# EAGLE design Nebula 1.3 (EAGLE 5.11)

## Sheet 1 of 5
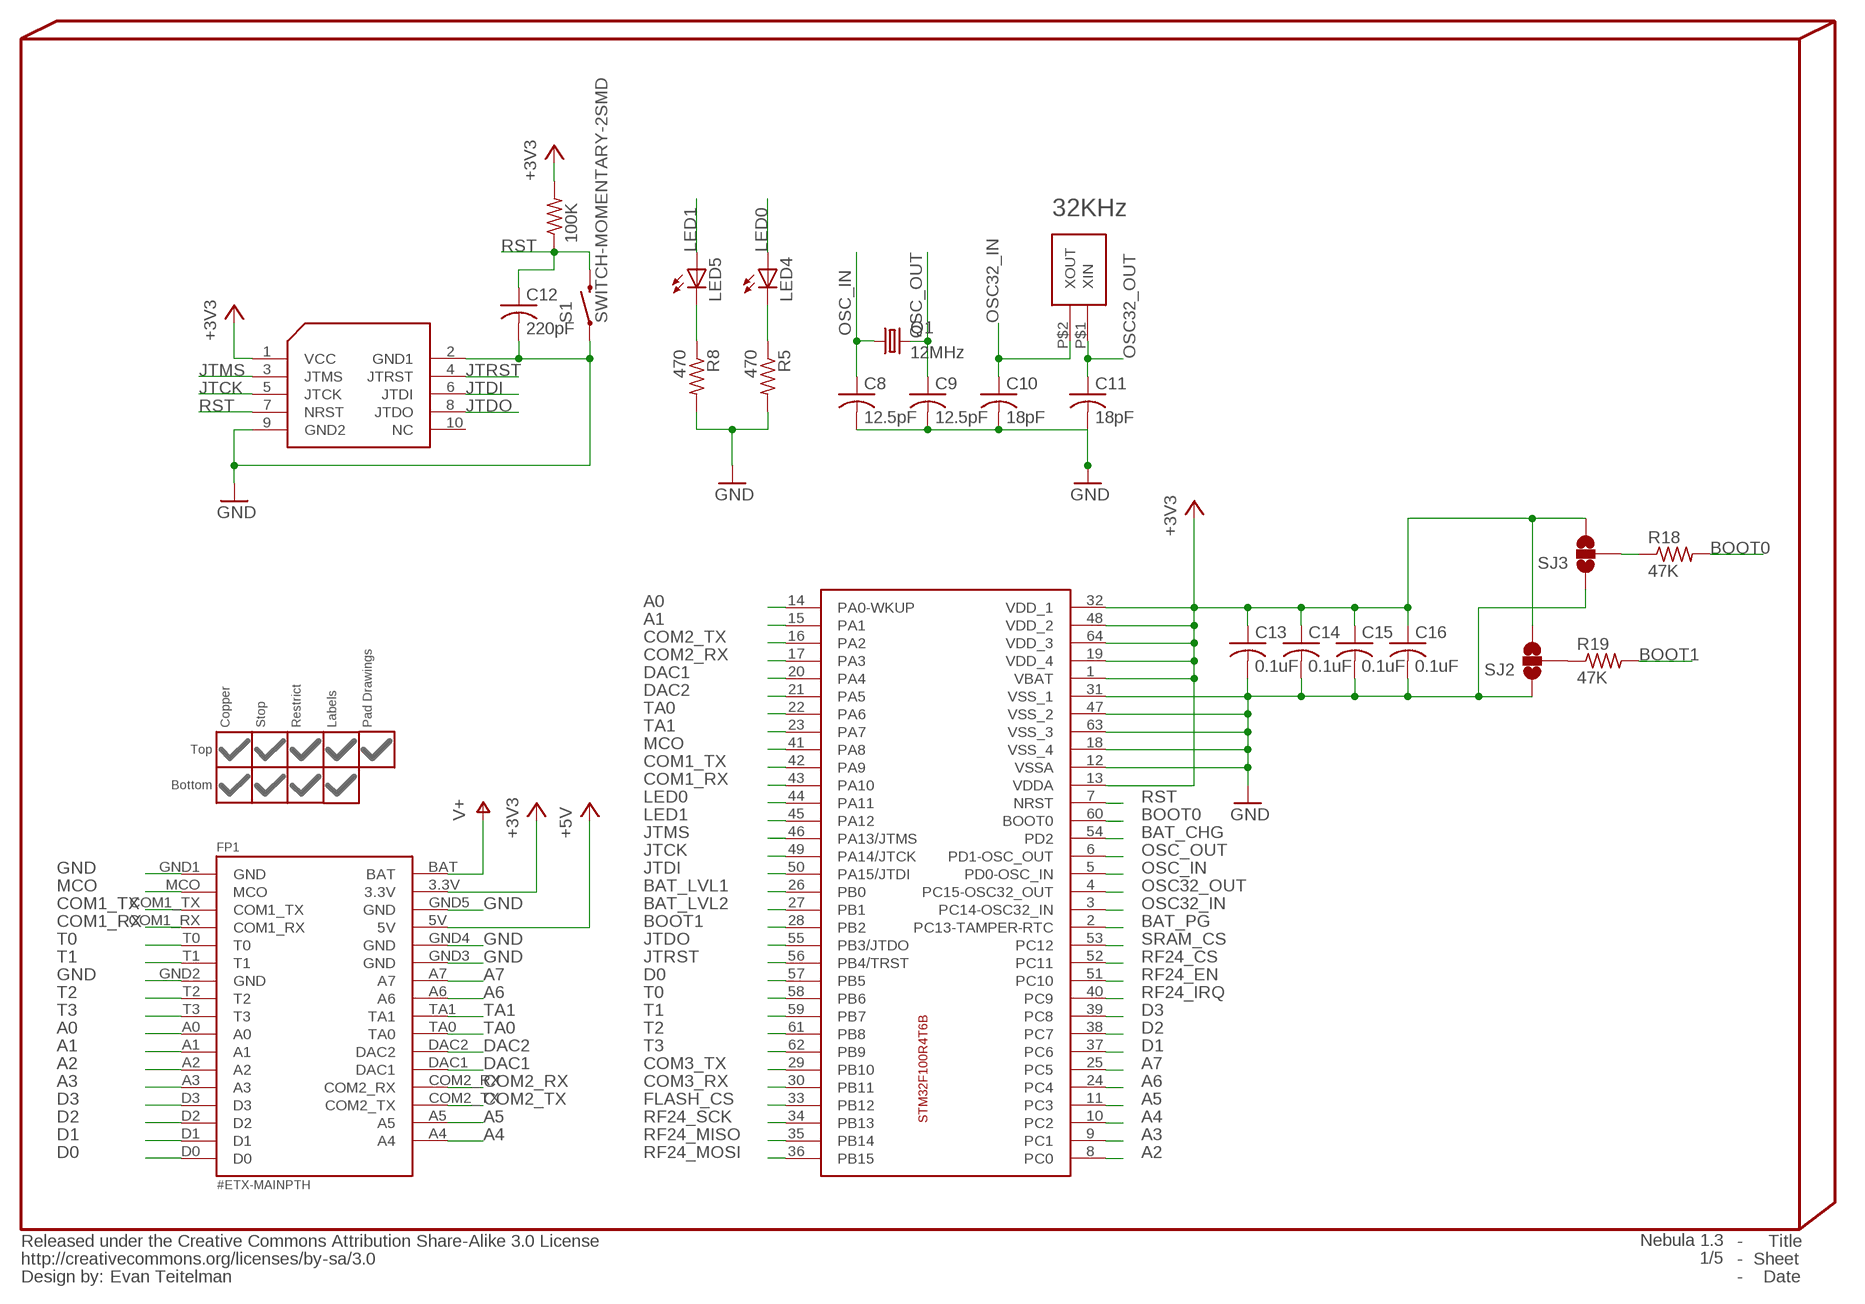
[diagram p0: schematic, sheet 1]

### Parts
C8  12.5pF  C-USC0402  [C0402]
C9  12.5pF  C-USC0402  [C0402]
C10  18pF  C-USC0402  [C0402]
C11  18pF  C-USC0402  [C0402]
C12  220pF  C-USC0402  [C0402]
C13  0.1uF  C-USC0402  [C0402]
C14  0.1uF  C-USC0402  [C0402]
C15  0.1uF  C-USC0402  [C0402]
C16  0.1uF  C-USC0402  [C0402]
FP1  #ETX-MAINPTH  [#ETX-HOLES]
INFO3  Evan Teitelman  CC-BY-SA  [CC-BY-SA]
LED4  LED0603  [LED-0603]
LED5  LED0603  [LED-0603]
PART1  #ETX-PARTLABELS_BOTTOM  [#ETX-LABELS_BOTT]
PART2  #ETX-PARTRESTRICT  [#ETX-RESTRICT]
PART3  #ETX-PARTSTOP  [#ETX-STOP]
Q1  12MHz  CRYSTAL5X3  [CRYSTAL-SMD-5X3]
Q2  CM415  [CM415]
R3  100K  R-US_R0402  [R0402]
R5  470  R-US_R0402  [R0402]
R8  470  R-US_R0402  [R0402]
R18  47K  R-US_R0402  [R0402]
R19  47K  R-US_R0402  [R0402]
S1  SWITCH-MOMENTARY-2SMD  [TACTILE_SWITCH_SMD]
SJ2  SOLDERJUMPER_2WAYPASTE1&2  [SJ_3_PASTE1&2]
SJ3  SOLDERJUMPER_2WAYPASTE1&2  [SJ_3_PASTE1&2]
U3  STM32F100R4T6B  [S-PQFP64-G64]
U$1  STM32-JTAG-10P  [STM32-JTAG-10P]

### Nets
+3V3: C13.1 C14.1 C15.1 C16.1 FP1.3.3V R3.2 SJ2.3 SJ3.3 U3.1(VBAT) U3.13(VDDA) U3.19(VDD_4) U3.32(VDD_1) U3.48(VDD_2) U3.64(VDD_3) U$1.1(VCC) ; also sheet 2,3,5
+5V: FP1.5V ; also sheet 3,4
A0: FP1.A0 U3.14(PA0-WKUP)
A1: FP1.A1 U3.15(PA1)
A2: FP1.A2 U3.8(PC0)
A3: FP1.A3 U3.9(PC1)
A4: FP1.A4 U3.10(PC2)
A5: FP1.A5 U3.11(PC3)
A6: FP1.A6 U3.24(PC4)
A7: FP1.A7 U3.25(PC5)
BAT_CHG: U3.54(PD2) ; also sheet 3
BAT_LVL1: U3.26(PB0) ; also sheet 3
BAT_LVL2: U3.27(PB1) ; also sheet 3
BAT_PG: U3.2(PC13-TAMPER-RTC) ; also sheet 3
BOOT0: R18.2 U3.60(BOOT0)
BOOT1: R19.2 U3.28(PB2)
COM1_RX: FP1.COM1_RX U3.43(PA10)
COM1_TX: FP1.COM1_TX U3.42(PA9)
COM2_RX: FP1.COM2_RX U3.17(PA3)
COM2_TX: FP1.COM2_TX U3.16(PA2)
COM3_RX: U3.30(PB11) ; also sheet 4
COM3_TX: U3.29(PB10) ; also sheet 4
D0: FP1.D0 U3.57(PB5)
D1: FP1.D1 U3.37(PC6)
D2: FP1.D2 U3.38(PC7)
D3: FP1.D3 U3.39(PC8)
DAC1: FP1.DAC1 U3.20(PA4)
DAC2: FP1.DAC2 U3.21(PA5)
FLASH_CS: U3.33(PB12) ; also sheet 5
GND: C8.2 C9.2 C10.2 C11.2 C12.2 C13.2 C14.2 C15.2 C16.2 FP1.GND1(GND) FP1.GND2(GND) FP1.GND3(GND) FP1.GND4(GND) FP1.GND5(GND) R5.2 R8.2 S1.1 SJ2.1 SJ3.1 U3.12(VSSA) U3.18(VSS_4) U3.31(VSS_1) U3.47(VSS_2) U3.63(VSS_3) U$1.2(GND1) U$1.9(GND2) ; also sheet 2,3,4,5
JTCK: U3.49(PA14/JTCK) U$1.5(JTCK)
JTDI: U3.50(PA15/JTDI) U$1.6(JTDI)
JTDO: U3.55(PB3/JTDO) U$1.8(JTDO)
JTMS: U3.46(PA13/JTMS) U$1.3(JTMS)
JTRST: U3.56(PB4/TRST) U$1.4(JTRST)
LED0: LED4.A U3.44(PA11)
LED1: LED5.A U3.45(PA12)
MCO: FP1.MCO U3.41(PA8)
N$31: R18.1 SJ3.2
N$33: R19.1 SJ2.2
N$35: LED5.C R8.1
N$37: LED4.C R5.1
OSC32_IN: C10.1 Q2.P$2(XOUT) U3.3(PC14-OSC32_IN)
OSC32_OUT: C11.1 Q2.P$1(XIN) U3.4(PC15-OSC32_OUT)
OSC_IN: C8.1 Q1.1 U3.5(PD0-OSC_IN)
OSC_OUT: C9.1 Q1.3 U3.6(PD1-OSC_OUT)
RF24_CS: U3.52(PC11) ; also sheet 2
RF24_EN: U3.51(PC10) ; also sheet 2
RF24_IRQ: U3.40(PC9) ; also sheet 2
RF24_MISO: U3.35(PB14) ; also sheet 2,5
RF24_MOSI: U3.36(PB15) ; also sheet 2,5
RF24_SCK: U3.34(PB13) ; also sheet 2,5
RST: C12.1 R3.1 S1.3 U3.7(NRST) U$1.7(NRST)
SRAM_CS: U3.53(PC12) ; also sheet 5
T0: FP1.T0 U3.58(PB6)
T1: FP1.T1 U3.59(PB7)
T2: FP1.T2 U3.61(PB8)
T3: FP1.T3 U3.62(PB9)
TA0: FP1.TA0 U3.22(PA6)
TA1: FP1.TA1 U3.23(PA7)
V+: FP1.BAT ; also sheet 3
Unconnected: U$1.10(NC)

## Sheet 2 of 5
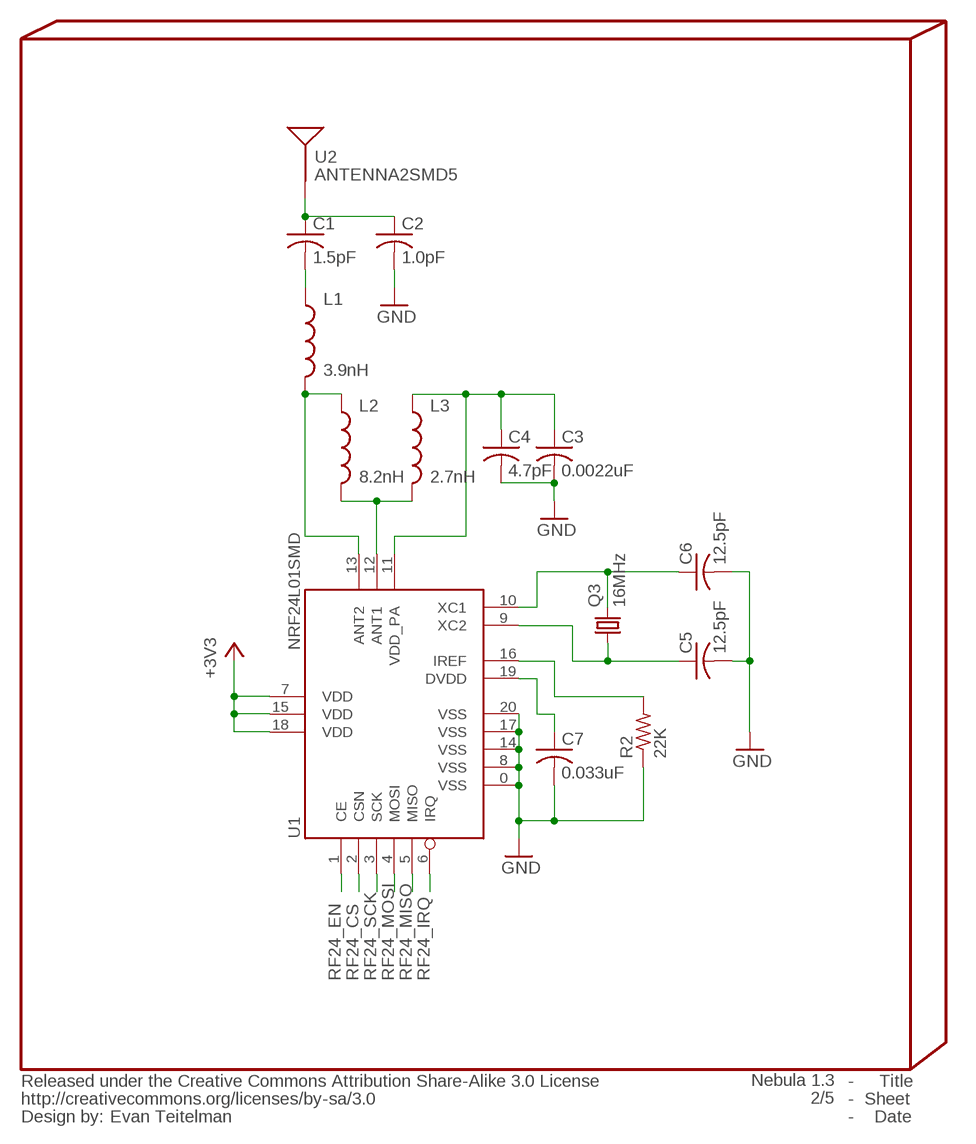
[diagram p1: schematic, sheet 2]

### Parts
C1  1.5pF  C-USC0402  [C0402]
C2  1.0pF  C-USC0402  [C0402]
C3  0.0022uF  C-USC0402  [C0402]
C4  4.7pF  C-USC0402  [C0402]
C5  12.5pF  C-USC0402  [C0402]
C6  12.5pF  C-USC0402  [C0402]
C7  0.033uF  C-USC0402  [C0402]
L1  3.9nH  INDUCTOR0402  [C0402]
L2  8.2nH  INDUCTOR0402  [C0402]
L3  2.7nH  INDUCTOR0402  [C0402]
Q3  16MHz  CRYSTAL5X3  [CRYSTAL-SMD-5X3]
R2  22K  R-US_R0402  [R0402]
U1  NRF24L01SMD  [QFN20]
U2  ANTENNA2SMD5  [ANTENNA-CHIP5]

### Nets
+3V3: U1.7(VDD) U1.15(VDD) U1.18(VDD) ; also sheet 1,3,5
GND: C2.2 C3.2 C4.2 C5.2 C6.2 C7.2 R2.1 U1.0(VSS) U1.8(VSS) U1.14(VSS) U1.17(VSS) U1.20(VSS) ; also sheet 1,3,4,5
N$1: C1.1 C2.1 U2.FEED(SIGNAL)
N$2: C1.2 L1.1
N$3: L1.2 L2.1 U1.13(ANT2)
N$4: L2.2 L3.2 U1.12(ANT1)
N$5: C3.1 C4.1 L3.1 U1.11(VDD_PA)
N$7: C6.1 Q3.3 U1.10(XC1)
N$8: C5.1 Q3.1 U1.9(XC2)
N$10: R2.2 U1.16(IREF)
N$11: C7.1 U1.19(DVDD)
RF24_CS: U1.2(CSN) ; also sheet 1
RF24_EN: U1.1(CE) ; also sheet 1
RF24_IRQ: U1.6(IRQ) ; also sheet 1
RF24_MISO: U1.5(MISO) ; also sheet 1,5
RF24_MOSI: U1.4(MOSI) ; also sheet 1,5
RF24_SCK: U1.3(SCK) ; also sheet 1,5

## Sheet 3 of 5
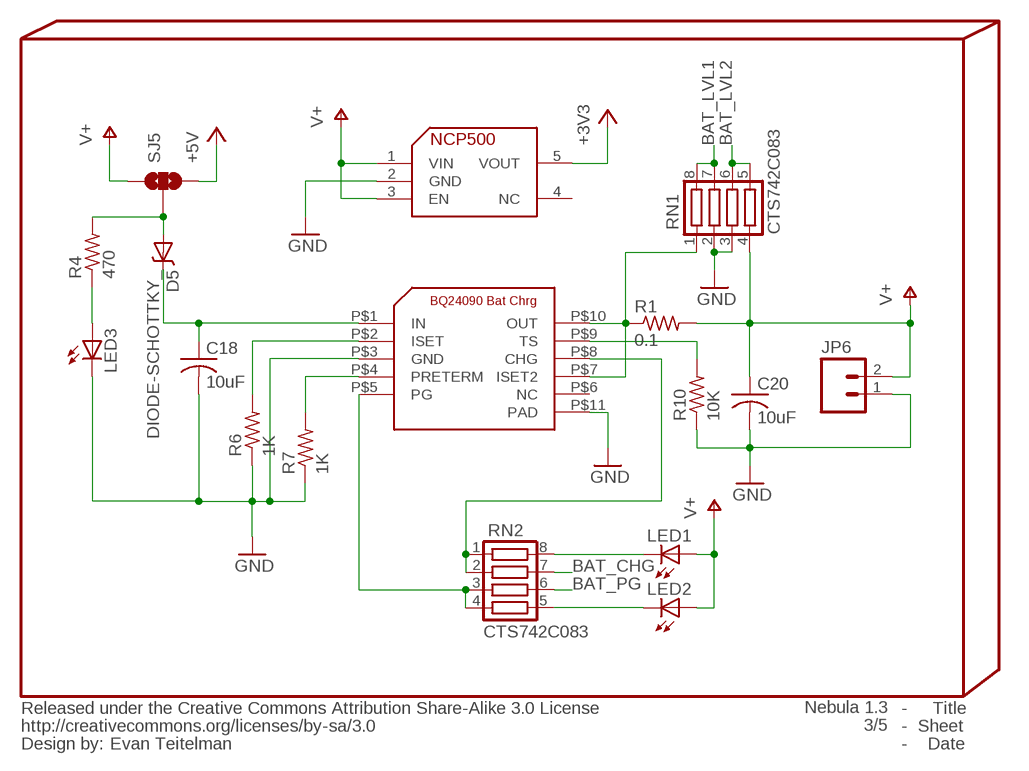
[diagram p2: schematic, sheet 3]

### Parts
C18  10uF  C-USC0805  [C0805]
C20  10uF  C-USC0805  [C0805]
D5  DIODE-SCHOTTKY_  [SMA-DIODE]
JP6  M02-JST-2MM-SMT  [JST-2-SMD]
LED1  LED0603  [LED-0603]
LED2  LED0603  [LED-0603]
LED3  LED0603  [LED-0603]
R1  0.1  R-US_R0805  [R0805]
R4  470  R-US_R0402  [R0402]
R6  1K  R-US_R0402  [R0402]
R7  1K  R-US_R0402  [R0402]
R10  10K  R-US_R0402  [R0402]
RN1  CTS742C083  [CTS742C083]
RN2  CTS742C083  [CTS742C083]
SJ5  SOLDERJUMPER_2WAYPASTE1&2  [SJ_3_PASTE1&2]
U6  BQ24090  [R-PDSO-G10]
U8  NCP500  [SOT23-5L]

### Nets
+3V3: U8.5(VOUT) ; also sheet 1,2,5
+5V: SJ5.3 ; also sheet 1,4
BAT_CHG: RN2.7 ; also sheet 1
BAT_LVL1: RN1.7 RN1.8 ; also sheet 1
BAT_LVL2: RN1.5 RN1.6 ; also sheet 1
BAT_PG: RN2.6 ; also sheet 1
GND: C18.2 C20.2 JP6.1 LED3.C R6.1 R7.1 R10.1 RN1.2 RN1.3 U6.P$3(GND) U6.P$11(PAD) U8.2(GND) ; also sheet 1,2,4,5
N$6: C18.1 D5.C U6.P$1(IN)
N$12: R6.2 U6.P$2(ISET)
N$13: R7.2 U6.P$4(PRETERM)
N$14: RN2.3 RN2.4 U6.P$5(PG)
N$15: LED3.A R4.1
N$16: R1.1 RN1.1 U6.P$7(ISET2) U6.P$10(OUT)
N$17: RN2.1 RN2.2 U6.P$8(CHG)
N$18: R10.2 U6.P$9(TS)
N$20: LED2.C RN2.5
N$23: LED1.C RN2.8
N$25: D5.A R4.2 SJ5.2
V+: C20.1 JP6.2 LED1.A LED2.A R1.2 RN1.4 SJ5.1 U8.1(VIN) U8.3(EN) ; also sheet 1
Unconnected: U6.P$6(NC) U8.4(NC)

## Sheet 4 of 5
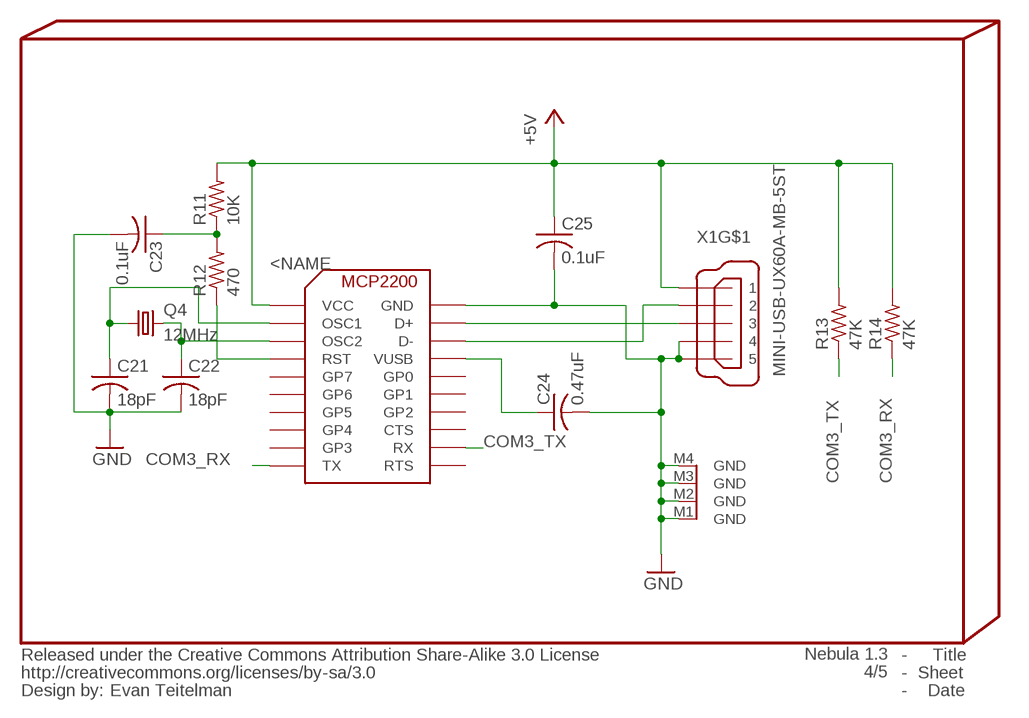
[diagram p3: schematic, sheet 4]

### Parts
C21  18pF  C-USC0402  [C0402]
C22  18pF  C-USC0402  [C0402]
C23  0.1uF  C-USC0402  [C0402]
C24  0.47uF  C-USC0402  [C0402]
C25  0.1uF  C-USC0402  [C0402]
Q4  12MHz  CRYSTAL5X3  [CRYSTAL-SMD-5X3]
R11  10K  R-US_R0402  [R0402]
R12  470  R-US_R0402  [R0402]
R13  47K  R-US_R0402  [R0402]
R14  47K  R-US_R0402  [R0402]
U7  MICROCHIP-USB-MCP2200  [QFN-20-5X5]
X1  MINI-USB-UX60A-MB-5ST  [UX60A-MB-5ST]

### Nets
+5V: C25.1 R11.2 R13.2 R14.2 U7.P18(VCC) X1.1 ; also sheet 1,3
COM3_RX: R14.1 U7.P7(TX) ; also sheet 1
COM3_TX: R13.1 U7.P9(RX) ; also sheet 1
GND: C21.2 C22.2 C23.2 C24.2 C25.2 U7.P17(GND) X1.4 X1.5 X1.M1(GND) X1.M2(GND) X1.M3(GND) X1.M4(GND) ; also sheet 1,2,3,5
N$19: C23.1 R11.1 R12.2
N$21: C22.1 Q4.3 U7.P20(OSC2)
N$22: C21.1 Q4.1 U7.P19(OSC1)
N$24: R12.1 U7.P1(RST)
N$26: U7.P15(D-) X1.2
N$28: C24.1 U7.P14(VUSB)
N$36: U7.P16(D+) X1.3
Unconnected: U7.P2(GP7) U7.P3(GP6) U7.P4(GP5) U7.P5(GP4) U7.P6(GP3) U7.P8(RTS) U7.P10(CTS) U7.P11(GP2) U7.P12(GP1) U7.P13(GP0)

## Sheet 5 of 5
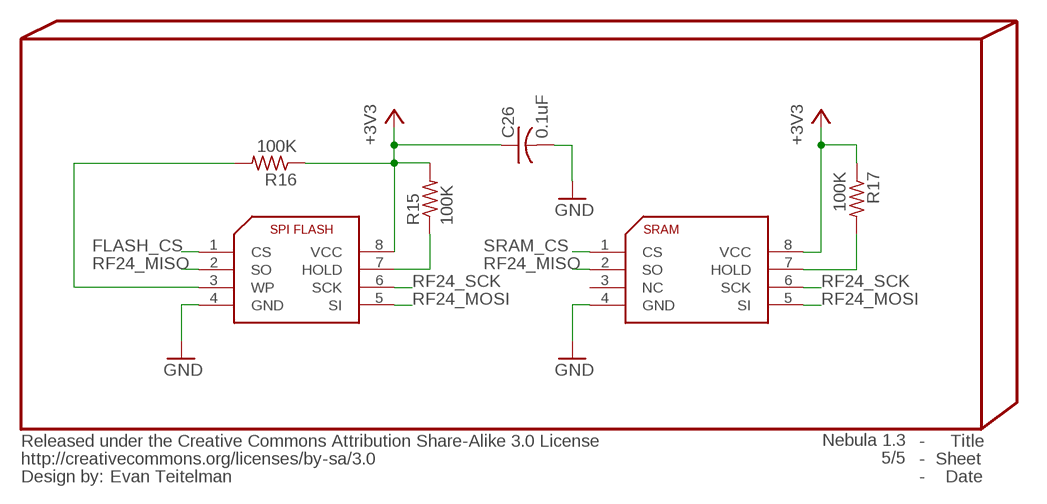
[diagram p4: schematic, sheet 5]

### Parts
C26  0.1uF  C-USC0402  [C0402]
R15  100K  R-US_R0402  [R0402]
R16  100K  R-US_R0402  [R0402]
R17  100K  R-US_R0402  [R0402]
U9  SST25VF080B  [SOIC8]
U10  N25S0830HA  [TSSOP8]

### Nets
+3V3: C26.1 R15.2 R16.1 R17.1 U9.8(VCC) U10.8(VCC) ; also sheet 1,2,3
FLASH_CS: U9.1(CS) ; also sheet 1
GND: C26.2 U9.4(GND) U10.4(GND) ; also sheet 1,2,3,4
N$27: R17.2 U10.7(HOLD)
N$30: R16.2 U9.3(WP)
N$32: R15.1 U9.7(HOLD)
RF24_MISO: U9.2(SO) U10.2(SO) ; also sheet 1,2
RF24_MOSI: U9.5(SI) U10.5(SI) ; also sheet 1,2
RF24_SCK: U9.6(SCK) U10.6(SCK) ; also sheet 1,2
SRAM_CS: U10.1(CS) ; also sheet 1
Unconnected: U10.3(NC)

## Library data of the parts
C1-C16 C18 C20-C26 = rcl:C-US: CAPACITOR, American symbol
D5 = SparkFun:DIODE-SCHOTTKY
FP1 = Pygmy:#ETX-MAIN: This is the only absolutely required part for the footprint It contains PTHs only. No "pretty pads".
INFO3 = EagleLbr:CC-BY-SA: Creative Commons Attribution-ShareAlike License <http://creativecommons.org/licenses/by-sa/3.0/>
JP6 = SparkFun:M02: Header 2 Standard 2-pin 0.1" header. Use with straight break away headers (SKU : PRT-00116), right angle break away headers (PRT-00553), swiss pins (PRT-00743), machine pins (PRT-00117), and female headers (PRT-00115). Molex polarized connector foot print use with SKU : PRT-08233 with associated crimp pins and housings.
L1-L3 = SparkFun:INDUCTOR: Inductors Basic Inductor/Choke - 0603 and 1206. Footprints are not proven and vary greatly between part numbers.
LED1-LED5 = SparkFun:LED: LEDs Standard schematic elements and footprints for 5mm, 3mm, 1206, and 0603 sized LEDs. 5mm - Spark Fun Electronics SKU : COM-00529 (and others)
PART1-PART3 = Pygmy:#ETX-PART: Footprint Parts Using the part manager is advised, but not required.
Q1 Q3 Q4 = SparkFun:CRYSTAL: Crystals Various standard crystals. Proven footprints. Spark Fun Electronics SKU : COM-00534
Q2 = dublib:CM415
R1-R8 R10-R19 = rcl:R-US_: RESISTOR, American symbol
RN1 RN2 = resistor-net:CTS742C083: Chip Resistor Array 4 Single Resistor Source: http://www.ctscorp.com/components/Datasheets/CTSChipArrayDs.pdf; OC_FARNELL: unknown; OC_NEWARK: unknown
S1 = SparkFun:SWITCH-MOMENTARY-2
SJ2 SJ3 SJ5 = Pygmy:SOLDERJUMPER_2WAY: Solder Jumper 2 way solder jumper
U1 = SparkFun:NRF24L01: 2.4GHz Low Power Transceiver This is the very popular, low cost, very low power RF transceiver from Nordic Semiconductor. Simple SPI interface. SKU: COM-00690
U2 = SparkFun:ANTENNA2: Antenna Single endded antenna. Common with smaller chip antennas. CHIP4 package is the GPS Chip Antenna SKU: GPS-08418. CHIP5 package is 2.4GHz chip antenna SKU: WRL-00144.
U3 = dublib:STM32F100R4T6B
U6 = dublib:BQ24090
U7 = dublib:MICROCHIP-USB-MCP2200
U8 = dublib:NCP500
U9 = dublib:SST25VF080B
U10 = dublib:N25S0830HA
U$1 = Pygmy:STM32-JTAG-10P
X1 = dublib:MINI-USB-: MINI USB Connector Source: http://www.hirose.co.jp/cataloge_hp/e24000019.pdf

## Board
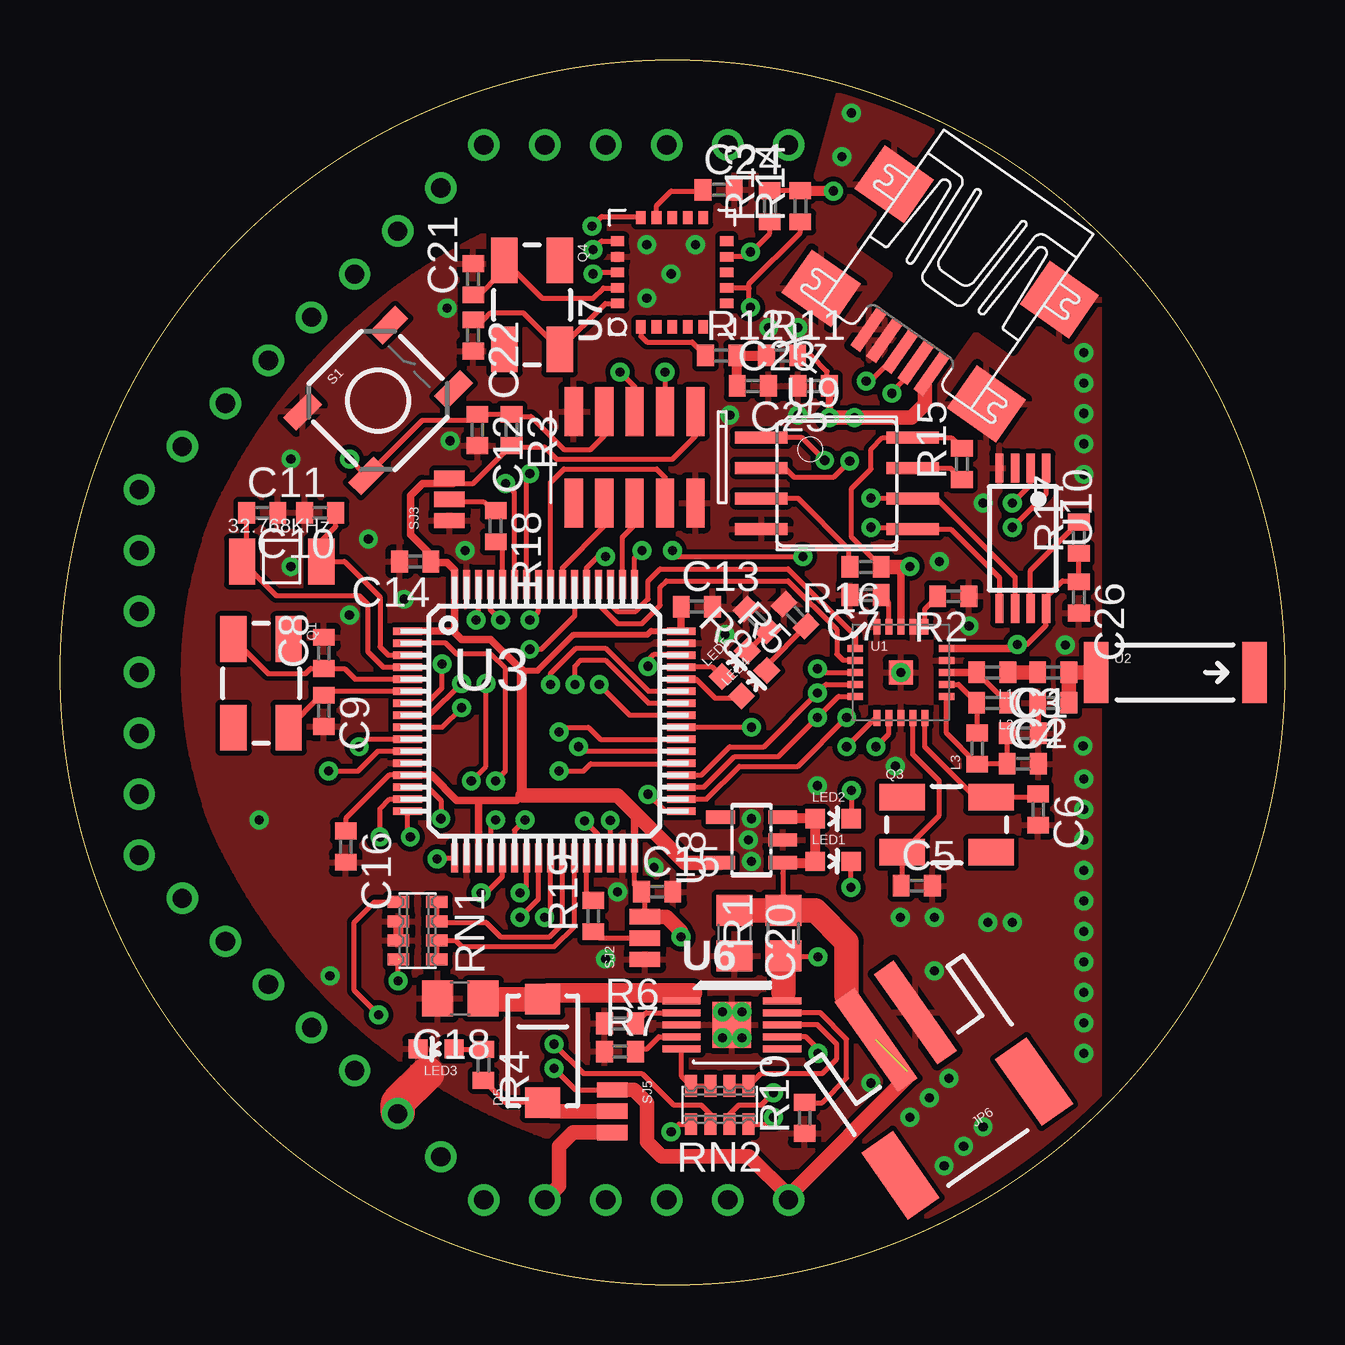
[diagram p5: board, top side]
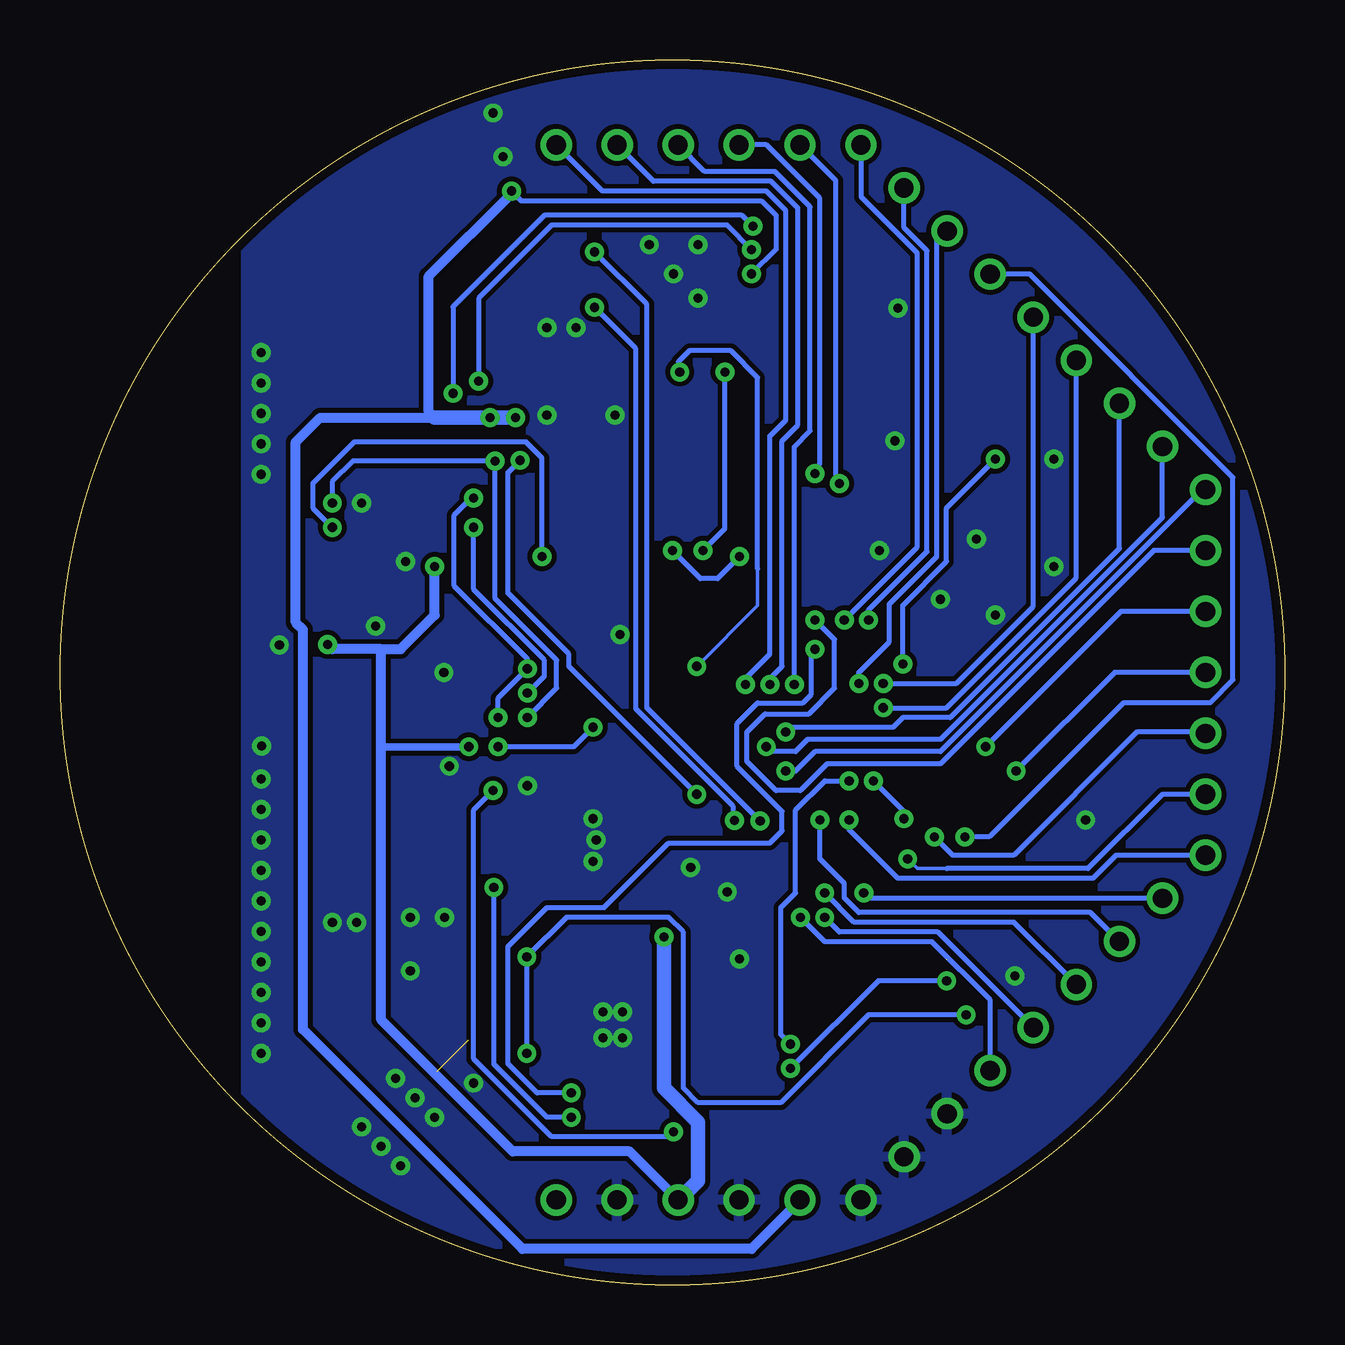
[diagram p6: board, bottom side, seen from below]

Size 51.05 x 51.05 mm. Coordinates in mm from the lower left corner, seen from the top.
Outline: circle at 25.53,25.53 radius 25.53
Copper layers (1*16): Top 0.035mm / dielectric 1.5mm / Bottom 0.035mm
Design rules "PDX (Proto)": minimum track width 6mil, minimum drill 15mil, track to track 6mil, track to pad 6mil, pad to pad 4mil, via to via 6mil, smd to smd 4mil, copper to edge 15mil, drill to drill 6mil, minimum pad ring 10mil, minimum via ring 8mil, stop-mask expansion 4mil, vias tented up to drill 0mil, thermal gap 10mil

### Footprints (pad centres in the part's own frame; a part is rotated, then mirrored left to right if it is on the bottom)
C0402 = smd 0.7 x 0.9: 1 -0.65,0; 2 0.65,0
C0805 = smd 1.3 x 1.5: 1 -0.95,0; 2 0.95,0
SMA-DIODE = smd 1.27 x 1.47: A -2.15,0; C 2.15,0
#ETX-HOLES = drill 0.8 round: 3.3V -0.237,-21.988; 5V -5.316,-21.988; A0 -11.448,18.396; A1 -13.245,16.6; A2 -15.04,14.804; A3 -16.837,13.008; A4 -22.225,2.54; A5 -22.225,0; A6 -15.04,-14.804; A7 -13.245,-16.6; BAT 4.843,-21.988; COM1_RX -0.236,21.988; COM1_TX 2.304,21.988; COM2_RX -22.225,-5.08; COM2_TX -22.225,-2.54; D0 -22.225,5.08; D1 -22.225,7.62; D2 -20.429,9.416; D3 -18.633,11.212; DAC1 -22.225,-7.62; DAC2 -20.429,-9.416; GND1 -11.448,-18.396; GND2 -9.652,-20.192; GND3 -7.856,-21.988; GND4 -2.776,-21.988; GND5 2.303,-21.988; MCO 4.844,21.988; T0 -2.776,21.988; T1 -5.316,21.988; T2 -7.856,21.988; T3 -9.652,20.192; TA0 -18.633,-11.212; TA1 -16.837,-13.008
JST-2-SMD = smd 1 x 4.6: 1 -1,-3.7; 2 1,-3.7 | smd 1.6 x 3.4: NC1 -3.4,1.5; NC2 3.4,1.5
LED-0603 = smd 0.8 x 0.8: A 0,-0.75; C 0,0.75
CRYSTAL-SMD-5X3 = smd 1.9 x 1.1: 1 -1.85,-1.15; 2 1.85,-1.15; 3 1.85,1.15; 4 -1.85,1.15
CM415 = smd 1.1 x 1.9: P$1 0,0; P$2 3.3,0
R0805 = smd 1.3 x 1.5: 1 -0.95,0; 2 0.95,0
R0402 = smd 0.7 x 0.9: 1 -0.65,0; 2 0.65,0
CTS742C083 = smd 0.5 x 0.9: 1 -1.2,-0.8; 2 -0.4,-0.8; 3 0.4,-0.8; 4 1.2,-0.8; 5 1.2,0.8; 6 0.4,0.8; 7 -0.4,0.8; 8 -1.2,0.8
TACTILE_SWITCH_SMD = smd 1.524 x 0.762: 1 -2.54,1.905; 2 2.54,1.905; 3 -2.54,-1.905; 4 2.54,-1.905
SJ_3_PASTE1&2 = smd 0.635 x 1.27: 1 -0.889,0; 2 0,0; 3 0.889,0
QFN20 = smd 1 x 1: 0 0,0 | smd 0.65 x 0.3: 1 -1.9,1; 2 -1.9,0.5; 3 -1.9,0; 4 -1.9,-0.5; 5 -1.9,-1; 11 1.9,-1; 12 1.9,-0.5; 13 1.9,0; 14 1.9,0.5; 15 1.9,1 | smd 0.3 x 0.65: 6 -1,-1.9; 7 -0.5,-1.9; 8 0,-1.9; 9 0.5,-1.9; 10 1,-1.9; 16 1,1.9; 17 0.5,1.9; 18 0,1.9; 19 -0.5,1.9; 20 -1,1.9
ANTENNA-CHIP5 = smd 1.016 x 2.54: FEED -3.302,0; NC 3.302,0
S-PQFP64-G64 = smd 1.2 x 0.3: 1 -5.7,3.75; 2 -5.7,3.25; 3 -5.7,2.75; 4 -5.7,2.25; 5 -5.7,1.75; 6 -5.7,1.25; 7 -5.7,0.75; 8 -5.7,0.25; 9 -5.7,-0.25; 10 -5.7,-0.75; 11 -5.7,-1.25; 12 -5.7,-1.75; 13 -5.7,-2.25; 14 -5.7,-2.75; 15 -5.7,-3.25; 16 -5.7,-3.75; 33 5.7,-3.75; 34 5.7,-3.25; 35 5.7,-2.75; 36 5.7,-2.25; 37 5.7,-1.75; 38 5.7,-1.25; 39 5.7,-0.75; 40 5.7,-0.25; 41 5.7,0.25; 42 5.7,0.75; 43 5.7,1.25; 44 5.7,1.75; 45 5.7,2.25; 46 5.7,2.75; 47 5.7,3.25; 48 5.7,3.75 | smd 0.3 x 1.2: 17 -3.75,-5.7; 18 -3.25,-5.7; 19 -2.75,-5.7; 20 -2.25,-5.7; 21 -1.75,-5.7; 22 -1.25,-5.7; 23 -0.75,-5.7; 24 -0.25,-5.7; 25 0.25,-5.7; 26 0.75,-5.7; 27 1.25,-5.7; 28 1.75,-5.7; 29 2.25,-5.7; 30 2.75,-5.7; 31 3.25,-5.7; 32 3.75,-5.7; 49 3.75,5.7; 50 3.25,5.7; 51 2.75,5.7; 52 2.25,5.7; 53 1.75,5.7; 54 1.25,5.7; 55 0.75,5.7; 56 0.25,5.7; 57 -0.25,5.7; 58 -0.75,5.7; 59 -1.25,5.7; 60 -1.75,5.7; 61 -2.25,5.7; 62 -2.75,5.7; 63 -3.25,5.7; 64 -3.75,5.7
R-PDSO-G10 = smd 0.3 x 1.6: P$1 0,0; P$2 0.5,0; P$3 1,0; P$4 1.5,0; P$5 2,0; P$6 2,4.2; P$7 1.5,4.2; P$8 1,4.2; P$9 0.5,4.2; P$10 0,4.2 | smd 1.9 x 1.6: P$11 1,2.1
QFN-20-5X5 = smd 0.55 x 0.4: P1 0,-0.975; P2 0,-1.625; P3 0,-2.275; P4 0,-2.925; P5 0,-3.575; P11 4.55,-3.575; P12 4.55,-2.925; P13 4.55,-2.275; P14 4.55,-1.625; P15 4.55,-0.975 | smd 0.4 x 0.55: P6 0.975,-4.55; P7 1.625,-4.55; P8 2.275,-4.55; P9 2.925,-4.55; P10 3.575,-4.55; P16 3.575,0; P17 2.925,0; P18 2.275,0; P19 1.625,0; P20 0.975,0
SOT23-5L = smd 0.55 x 1.2: 1 -0.95,-1.3; 2 0,-1.3; 3 0.95,-1.3; 4 0.95,1.3; 5 -0.95,1.3
SOIC8@1 = smd 0.5 x 2.2: 1 -1.905,-3.154; 2 -0.645,-3.154; 3 0.625,-3.154; 4 1.895,-3.154; 5 1.905,3.154; 6 0.635,3.154; 7 -0.635,3.154; 8 -1.905,3.154
TSSOP8 = smd 1.2 x 0.35: 1 -2.925,0.975; 2 -2.925,0.325; 3 -2.925,-0.325; 4 -2.925,-0.975; 5 2.925,-0.975; 6 2.925,-0.325; 7 2.925,0.325; 8 2.925,0.975
STM32-JTAG-10P = smd 0.762 x 2.032: 1 0,0; 2 0,3.81; 3 1.27,0; 4 1.27,3.81; 5 2.54,0; 6 2.54,3.81; 7 3.81,0; 8 3.81,3.81; 9 5.08,0; 10 5.08,3.81
UX60A-MB-5ST = smd 2 x 0.5: 1 2.25,1.6; 2 2.25,0.8; 3 2.25,0; 4 2.25,-0.8; 5 2.25,-1.6 | smd 2.2 x 2.5: M1 -3.3,-4.2; M2 -3.3,4.2; M3 2,4.2; M4 2,-4.2

### Placement (x,y rotation side)
C1  41.4,25.53 180 top
C2  41.4,24.26 180 top
C3  40.13,22.99 0 top
C4  40.13,21.72 0 top
C5  35.71,16.64 0 top
C6  40.77,19.81 270 top
C7  33.58,28.75 180 top
C8  11,26.34 90 top
C9  11,23.93 270 top
C10  10.85,32.18 180 top
C11  8.43,32.18 0 top
C12  17.4,35.64 270 top
C13  26.54,28.27 0 top
C14  14.81,30.15 180 top
C15  24.89,16.38 0 top
C16  11.91,18.26 270 top
C18  16.68,11.94 180 top
C20  28.12,14.66 270 top
C21  17.22,41.91 90 top
C22  17.22,39.57 270 top
C23  28.88,37.47 0 top
C24  27.46,45.64 0 top
C25  31.42,37.47 180 top
C26  42.47,28.65 270 top
D5  20.12,9.75 90 top
FP1  25.53,25.53 0 top
INFO3  -4.95,-12.57 0 top  (outside the outline)
JP6  36.96,7.75 215 top
L1  38.86,25.53 180 top
L2  38.86,24.26 180 top
L3  38.23,22.35 90 top
LED1  32.23,17.65 270 top
LED2  32.23,19.43 270 top
LED3  15.67,9.83 90 top
LED4  28.93,25.07 315 top
LED5  28.12,25.88 315 top
PART1  25.53,25.53 0 top
PART2  25.53,25.53 0 top
PART3  25.53,25.53 0 top
Q1  8.38,25.07 270 top
Q2  7.59,30.15 0 top
Q3  36.96,19.18 0 top
Q4  19.68,40.84 270 top
R1  30.15,14.66 90 top
R2  37.24,28.7 180 top
R3  18.82,35.64 270 top
R4  17.65,9.17 270 top
R5  30.64,27.91 135 top
R6  23.34,10.9 0 top
R7  23.34,9.73 0 top
R8  29.05,27.71 135 top
R10  31.04,6.96 90 top
R11  30.1,38.73 0 top
R12  27.56,38.73 0 top
R13  29.59,44.96 90 top
R14  30.86,44.96 90 top
R15  37.59,34.21 90 top
R16  33.58,29.92 180 top
R17  42.47,31.14 90 top
R18  18.16,31.62 270 top
R19  22.23,15.37 90 top
RN1  14.91,14.76 270 top
RN2  27.51,7.49 180 top
S1  13.26,36.86 45 top
SJ2  24.38,14.45 90 top
SJ3  16.23,32.74 90 top
SJ5  23.01,7.24 270 top
U1  35.05,25.53 0 top
U2  46.48,25.53 0 top
U3  20.19,23.5 0 top
U6  25.91,11.84 270 top
U7  23.24,39.93 90 top
U8  28.83,18.54 90 top
U9  SST25VF080B  [SOIC8@1]  32.39,33.4 270 top
U10  40.13,31.11 270 top
U$1  26.49,36.4 180 top
X1  36.32,40.77 235 top

### Tracks (layer width: path | path; a pad name or v marks a point on that pad's centre or on a via)
+3V3  (via drill 0.38)
  Top 0.203: U3.64 16.44,29.23 | U9.8 35.43,35.2 | U$1.1 26.49,35.38 25.53,34.42 20.7,34.42 20.19,34.92 18.88,34.92 R3.2 18.82,35 17.22,33.4 16.38,33.4 16.23,33.55 SJ3.3 | U3.32 23.94,16.68 C15.1 24.38,16.24 SJ2.3 | R17.1 C26.1 42.43,29.34 41.78,29.34 41.11,28.66 U10.8 | U10.8 41.1,27.48 40.31,26.7 v39.9,26.7 | U1.7 34.55,22.97 v34.01,22.43 | 34.42,29.85 34.31,29.85 34.01,30.15 | 34.01,30.15 33,31.17 33,33.2 33.81,34.01 33.81,34.82 34.29,35.31 U9.8 | U9.8 37.15,35.31 R15.2 | 23.94,19.57 23.65,19.87 23.65,19.99 | R16.1 34.01,30.14 34.01,30.15 | 11.91,19.24 C16.1 11.91,19.43 13.73,21.25 U3.13 | 19.25,20.42 19.25,20.22
  Top 0.254: 19.25,25.6 19.91,25.6 21.41,27.1 24.49,27.1 24.64,27.25 25.88,27.25 U3.48
  Top 0.305: U3.19 17.44,20.1 17.35,20.19 | U3.32 23.94,19.57 | U3.13 15.48,21.25 16.54,20.19 17.35,20.19 | U10.8 | 16.39,27.25 U3.1 | 19.25,25.6 17.96,26.9 16.74,26.9 16.39,27.25 | U3.64 16.44,27.3 16.39,27.25 | U3.48 C13.1 | 16.38,33.4 15.11,33.4 14.61,32.89 14.61,31.27 15.32,30.56 15.32,30.29 C14.1 15.51,30.1 16.13,30.1 16.44,29.79 16.44,29.23 | U1.15 39.94,26.53 39.94,26.66 v39.9,26.7 | U1.18 35.05,29.69 34.82,29.92 | 17.35,20.19 19.03,20.19 19.25,20.42 19.28,20.4
  Top 0.406: 19.25,20.42 19.25,25.6
  Top 0.61: U8.5 26.05,17.59 23.65,19.99 23.24,20.4 19.28,20.4 | v25.88,14.5 25.88,14.73 25.27,15.34 SJ2.3 | R16.1 34.82,29.92 35.41,29.92 v35.43,29.95
  Bottom 0.305: 37.67,22.43 v34.01,22.43
  Bottom 0.406: 37.67,26.49 37.67,22.43 37.67,11.05 32.18,5.56 27.31,5.56 FP1.3.3V | 37.67,26.49 36.86,26.49 35.43,27.92 v35.43,29.95 | v39.9,26.7 39.7,26.49 37.67,26.49
  Bottom 0.61: FP1.3.3V 25.27,3.54 24.46,4.34 24.46,6.78 25.88,8.2 v25.88,14.5
+5V  (via drill 0.38)
  Top 0.203: R13.2 R14.2 30.88,45.59 | 36.04,37.71 X1.1 | R11.2 31.32,38.73 31.98,38.08 31.98,37.56 C25.1 | U7.P18 22.29,42.2 v22.23,42.14
  Top 0.305: 36.04,37.47 36.04,37.71 | v32.07,36.14 C25.1
  Top 0.406: v32.23,45.59 30.88,45.59
  Top 0.61: 36.04,37.47 36.04,36.7 35.48,36.14 v33.12,36.14 v32.07,36.14 | SJ5.3 21.39,6.35 20.8,5.77 20.8,4.13 FP1.5V
  Bottom 0.203: v22.23,42.14 21.21,43.16 21.21,44.58 21.82,45.19 31.83,45.19 v32.23,45.59
  Bottom 0.406: 32.23,45.49 35.69,42.04 35.69,36.4 35.43,36.14 | v32.07,36.14 40.21,36.14 41.22,35.13 41.22,27.61 40.92,27.31 40.92,10.64 31.78,1.5 22.23,1.5 20.21,3.51 FP1.5V
  Bottom 0.61: 32.23,45.49 v32.23,45.59 | v32.07,36.14 35.43,36.14
A0  (via drill 0.38)
  Top 0.203: 14.85,20.75 U3.14 15.32,20.75 15.88,20.19 v15.88,19.43 | v17.14,21.01 17.75,21.62 v17.75,25.07
  Bottom 0.203: FP1.A0 14.5,43.5 14.5,30.35 16.48,28.37 16.48,26.8 17.75,25.53 v17.75,25.07 | v15.88,19.43 15.88,19.74 v17.14,21.01
A1  (via drill 0.38)
  Top 0.203: v13.34,18.67 13.34,19.84 13.74,20.24 U3.15
  Bottom 0.203: v13.34,18.67 12.32,18.67 6.73,24.26 3.12,24.26 2.16,25.22 2.16,33.66 10.63,42.13 FP1.A1
A2  (via drill 0.38)
  Top 0.203: U3.8 15.41,23.75 v16.74,25.07
  Bottom 0.203: v16.74,25.07 13.69,25.07 10.49,28.27 FP1.A2
A3  (via drill 0.38)
  Top 0.203: U3.9 15.93,23.25 v16.74,24.05
  Bottom 0.203: v16.74,24.05 14.1,24.05 8.69,29.46 FP1.A3
A4  (via drill 0.38)
  Top 0.203: U3.10 12.79,22.75 v12.47,22.43
  Bottom 0.203: v12.47,22.43 6.83,28.07 FP1.A4
A5  (via drill 0.38)
  Top 0.203: U3.11 13.25,22.25 12.42,21.41 v11.2,21.41
  Bottom 0.203: v11.2,21.41 7.09,25.53 FP1.A5
A6  (via drill 0.38)
  Top 0.203: U3.24 19.94,16.08 v19.18,15.32
  Bottom 0.203: v19.18,15.32 18.57,14.71 14.47,14.71 FP1.A6
A7  (via drill 0.38)
  Top 0.203: U3.25 20.44,15.57 v20.19,15.32
  Bottom 0.203: v20.19,15.32 19.18,14.3 14.71,14.3 12.28,11.88 FP1.A7
BAT_CHG  (via drill 0.38)
  Top 0.203: U3.54 21.46,29.18 21.46,27.89 20.07,26.49 v19.58,26.49 | RN2.7 27.91,7.11 28.3,7.49 29.24,7.49 v29.74,8
  Bottom 0.203: v29.74,8 31.17,8 32.39,9.22 32.39,14.1 30.76,15.72 28.37,15.72 25.68,18.41 21.46,18.41 20.96,18.92 20.96,19.74 22.84,21.62 22.84,23.39 21.97,24.26 20.09,24.26 19.74,24.61 19.74,26.34 v19.58,26.49
BAT_LVL1
  Top 0.203: RN1.8 RN1.7 15.75,15.11 17.75,15.11 18.36,14.5 20.4,14.5 20.94,15.05 U3.26
BAT_LVL2
  Top 0.203: U3.27 21.44,14.94 20.6,14.1 16.74,14.1 16.48,14.35 RN1.6 RN1.5 15.84,13.69
BAT_PG  (via drill 0.38)
  Top 0.203: U3.2 16.08,26.75 16.54,26.29 17.96,26.29 18.57,25.68 18.57,21.41 v18.16,21.01 | RN2.6 27.11,7.11 26.72,7.49 25.58,7.49 24.26,8.81 21.82,8.81 v20.6,10.03
  Bottom 0.203: v18.16,21.01 19.18,21.01 20.4,19.79 20.4,16.33 21.01,15.72 21.01,10.44 v20.6,10.03
BOOT0
  Top 0.203: U3.60 18.44,30.69 R18.2
BOOT1
  Top 0.203: U3.28 21.94,16.3 R19.2
COM1_RX  (via drill 0.38)
  Top 0.203: U3.43 24.53,24.75 22.73,26.54 21.51,26.54 20.45,25.48 v20.45,25.02
  Bottom 0.203: v20.45,25.02 20.45,34.92 19.79,35.58 19.79,44.93 21.26,46.41 24.18,46.41 FP1.COM1_RX
COM1_TX  (via drill 0.38)
  Top 0.203: U3.42 24.52,24.25 22.73,26.04 21.72,26.04 21.46,25.78 v21.46,25.02
  Bottom 0.203: v21.46,25.02 21.46,25.27 20.96,25.78 20.96,35.18 20.3,35.84 20.3,44.88 21.41,46 26.32,46 FP1.COM1_TX
COM2_RX  (via drill 0.38)
  Top 0.203: U3.17 15.76,17.8 v15.72,17.75
  Bottom 0.152: 14.1,17.35 15.32,17.35 v15.72,17.75
  Bottom 0.203: 14.1,17.35 8.2,17.35 5.11,20.45 FP1.COM2_RX
COM2_TX  (via drill 0.38)
  Top 0.203: U3.16 14.49,18.78 v14.61,18.67
  Bottom 0.203: v14.61,18.67 13.84,17.91 11.3,17.91 6.17,23.04 3.35,23.04 FP1.COM2_TX
COM3_RX  (via drill 0.38)
  Top 0.203: U3.30 v22.94,19.35 v22.94,19.36 | 28.83,40.79 v28.78,40.74 28.73,40.79 28.73,41.53 | R14.1 30.86,43.87 28.73,41.73 28.73,41.53 | U7.P7 28.7,41.55 28.73,41.53
  Bottom 0.203: v22.94,19.36 22.99,19.41 22.99,19.94 27.05,24 27.05,39.01 v28.78,40.74
COM3_TX  (via drill 0.38)
  Top 0.203: R13.1 29.59,43.81 28.83,43.05 v28.78,43.05 28.58,42.85 U7.P9 | U3.29 22.44,18.76 v21.87,19.33
  Bottom 0.203: v21.87,19.33 26.59,24.05 26.59,40.87 v28.78,43.05
D0  (via drill 0.38)
  Top 0.203: U3.57 19.94,28.07 v19.58,27.71
  Bottom 0.203: v19.58,27.71 18.77,26.9 18.77,24.87 19.84,23.8 21.67,23.8 22.43,23.04 22.43,21.82 21.21,20.6 20.19,20.6 19.07,21.72 14.35,21.72 5.46,30.61 FP1.D0
D1  (via drill 0.38)
  Top 0.203: U3.37 25.87,21.72 22.12,21.72 21.82,21.41 v20.8,21.41
  Bottom 0.203: v20.8,21.41 20.4,21.41 19.58,22.23 14.35,22.23 3.43,33.15 FP1.D1
D2  (via drill 0.38)
  Top 0.203: U3.38 21.64,22.25 21.64,22.4 v21.62,22.43
  Bottom 0.203: v21.62,22.43 21.41,22.23 20.4,22.23 19.89,22.73 14.35,22.73 5.1,31.99 FP1.D2
D3  (via drill 0.38)
  Top 0.203: U3.39 25.88,22.73 22.53,22.73 22.02,23.24 21.01,23.24 v20.8,23.04
  Bottom 0.203: v20.8,23.04 20.6,23.24 16.33,23.24 15.93,23.65 13.95,23.65 6.9,30.7 FP1.D3
DAC1  (via drill 0.38)
  Top 0.203: U3.20 17.94,19.16 v18.16,19.38
  Bottom 0.203: v18.16,19.38 18.16,18.97 16.13,16.94 8,16.94 7.04,17.91 FP1.DAC1
DAC2  (via drill 0.38)
  Top 0.203: U3.21 18.44,17.02 17.75,16.33 v17.55,16.33
  Bottom 0.203: v17.55,16.33 17.33,16.11 FP1.DAC2
FLASH_CS  (via drill 0.38)
  Top 0.203: v31.88,34.37 30.94,35.31 U9.1 | U3.33 25.21,19.75 v24.51,20.45
  Bottom 0.203: v31.88,34.37 32.39,33.86 32.39,28.83 29.85,26.29 29.85,25.78 v24.51,20.45
GND  (via drill 0.38)
  Top 0.203: C3.2 40.78,24.23 C2.2
  Top 0.406: RN1.3 RN1.2
  Top 1.016: FP1.GND1 14.08,7.17
  Top 1.422: 14.08,7.17 14.08,7.58 15.32,8.81
  other vias: 35.03,15.32 38.48,32.59 42.67,36.32 41.91,26.67 42.67,37.59 42.67,35.05 42.67,33.78 38.68,15.11 27.91,36.25 42.67,38.86 32.99,48.84 14.35,28.57 16.26,35.18 36.45,15.32 42.65,22.45 42.67,21.08 42.67,19.81 42.67,18.54 42.67,17.27 42.67,16 42.67,14.73 39.7,15.11 42.67,10.92 42.67,12.19 42.67,13.46 42.67,9.65 28.7,18.54 8.31,19.38 36.65,30.15 37.9,27.46 27.61,11.38 28.42,11.38 27.61,10.29 28.42,10.29 16.89,30.61 12.85,31.09 24.77,17.4 23.24,16.38 28.83,19.43 28.83,17.65 22.73,13.59 30.76,39.9 29.54,39.9 27.71,27.1 35.05,25.53 36.45,13.08 37.06,8.61 36.25,7.8 35.43,6.99 38.48,6.58 37.67,5.77 36.86,4.95 11.25,12.88 9.63,34.42 9.63,29.95 12.07,27.91 24.46,43.36 25.48,42.14 24.46,41.12 26.49,43.36 30.76,36.25 32.59,47.02 33.81,8.41 16.13,40.72 34.82,21.62 31.57,20.8
  pour Top (isolate 0.203): -2.41,53.47 43.31,53.47 43.31,-2.41 -2.41,-2.41
  pour Bottom (isolate 0.203): -4.95,56.01 43.31,56.01 43.31,-4.95 -4.95,-4.95
JTCK  (via drill 0.38)
  Top 0.203: 23.93,29.18 U3.49 23.94,30.29 v24.26,30.61 | U$1.5 23.95,37.44 v23.34,38.05
  Bottom 0.203: v23.34,38.05 23.34,31.52 v24.26,30.61
JTDI
  Top 0.203: U3.50 23.44,31.17 23.95,31.67 U$1.6
JTDO
  Top 0.203: U3.55 20.94,29.88 22.68,31.62 U$1.8
JTMS  (via drill 0.38)
  Top 0.203: v25.22,38.05 U$1.3 | v24.51,25.78 24.51,26.04 24.77,26.29 25.85,26.29 U3.46
  Bottom 0.152: 21.97,29.85 21.97,28.32 v24.51,25.78
  Bottom 0.203: 21.97,29.85 21.97,37.82 23.09,38.94 24.82,38.94 25.27,38.48 25.27,38.1 v25.22,38.05
JTRST
  Top 0.203: U$1.4 25.22,33.66 24.87,34.01 21.01,34.01 20.44,33.45 U3.56
LED0
  Top 0.203: U3.44 26.52,25.25 27.31,24.46 28.32,24.46 LED4.A
LED1
  Top 0.203: U3.45 27.2,25.75 LED5.A
MCO  (via drill 0.38)
  Top 0.203: U3.41 25.79,23.75 25.78,23.75 23.75,23.75 v22.48,25.02
  Bottom 0.203: v22.48,25.02 22.48,25.27 21.46,26.29 21.46,35.38 20.8,36.04 20.8,44.78 21.62,45.59 28.45,45.59 FP1.MCO
N$1
  Top 0.61: U2.FEED C1.1 C2.1
N$2
  Top 0.61: L1.1 C1.2
N$3
  Top 0.203: 38.21,25.56 L1.2 38.23,25.53 L2.1
  Top 0.305: L1.2 U1.13
N$4
  Top 0.203: U1.12 37.46,25.03 38.23,24.26 L2.2 38.21,23.02 L3.2
N$5
  Top 0.203: C3.1 C4.1 39.47,21.7 L3.1 36.95,22.99 U1.11
N$6
  Top 0.203: 20.33,12.17 20.33,12.12 D5.C | U6.P$1 25.91,12.14 25.88,12.17
  Top 0.813: 20.33,12.17 25.88,12.17 26.37,12.17
  Top 1.016: D5.C 17.67,11.9 C18.1
N$7
  Top 0.203: C6.1 40.63,20.33 Q3.3 38.74,20.4 38.08,20.4 36.05,22.42 U1.10
N$8
  Top 0.203: U1.9 35.55,22.11 36.65,21.01 36.65,19.57 Q3.1 35.11,16.68 C5.1
N$10
  Top 0.203: U1.16 36.05,28.17 R2.2
N$11
  Top 0.203: U1.19 34.55,28.43 C7.1
N$12
  Top 0.203: U6.P$2 24.43,11.34 R6.2
N$13
  Top 0.203: U6.P$4 24.97,10.34 24.46,9.83 24.09,9.83 R7.2
N$14
  Top 0.203: RN2.3 RN2.4 25.91,8.69 U6.P$5
N$15
  Top 0.203: R4.1 16.43,9.82 LED3.A
N$16  (via drill 0.38)
  Top 0.203: U6.P$7 31.09,10.34 31.6,9.83 v31.6,9.65 | 30.11,12.43 U6.P$10 30.11,12.15 30.15,12.19 | v31.6,13.66 30.19,13.66 R1.1 | RN1.1 13.11,15.96 12.27,15.11 12.27,12.27 v13.28,11.25
  Top 1.016: R1.1 30.15,12.19
  Bottom 0.203: v31.6,9.65 v31.6,13.66 29.95,15.32 25.68,15.32 25.07,14.71 25.07,8.2 24.46,7.6 21.01,7.6 17.35,11.25 v13.28,11.25
N$17
  Top 0.203: RN2.2 RN2.1 29.23,8.81 31.78,8.81 32.39,9.42 32.39,10.03 31.58,10.84 U6.P$8
N$18
  Top 0.203: U6.P$9 31.69,11.34 32.79,10.24 32.79,8.61 31.78,7.6 31.05,7.6 R10.2
N$19
  Top 0.203: 28.21,37.69 28.23,37.67 C23.1
  Top 0.406: 28.21,37.69 R12.2 R11.1
N$20  (via drill 0.38)
  Top 0.203: RN2.5 25.79,6.69 v25.48,6.38 | v33,20.6 33,19.44 LED2.C
  Bottom 0.203: v25.48,6.38 25.68,6.17 30.56,6.17 33.81,9.42 33.81,19.79 v33,20.6
N$21
  Top 0.203: U7.P20 22.74,40.9 Q4.3 19.3,40.51 17.96,40.51 17.67,40.22 C22.1
N$22
  Top 0.203: U7.P19 22.66,41.55 22.23,41.12 20.1,41.12 Q4.1 18.36,42.53 18.36,42.14 17.49,41.26 C21.1
N$23  (via drill 0.38)
  Top 0.203: v32.97,16.56 32.97,17.64 LED1.C | RN2.8 29.45,6.69 v29.74,6.99
  Bottom 0.203: v32.97,16.56 32.97,9.2 30.76,6.99 v29.74,6.99
N$24
  Top 0.203: 24.22,39.79 U7.P1 24.22,39.54 24.46,39.29 26.35,39.29 R12.1
N$25
  Top 0.203: D5.A 18.57,7.6 R4.2
  Top 0.61: SJ5.2 20.48,7.24 D5.A
N$26  (via drill 0.38)
  Top 0.203: v34.67,37.16 34.92,37.41 34.92,37.47 35.69,38.23 X1.2 | U7.P15 24.17,44.53 22.58,44.53 v22.17,44.12
  Bottom 0.203: v22.17,44.12 22.63,44.58 30.86,44.58 34.67,40.77 v34.67,37.16
N$27
  Top 0.203: U10.7 40.46,29.78 R17.2
N$28
  Top 0.203: U7.P14 24.87,44.98 25.48,45.59 26.76,45.59 C24.1
N$30
  Top 0.203: U9.3 30.78,32.78 32.89,30.66 32.89,29.96 R16.2
N$31
  Top 0.203: R18.1 18.02,32.27 17.65,32.64 16.33,32.64 SJ3.2
N$32
  Top 0.203: U9.7 37.12,34.04 R15.1
N$33
  Top 0.203: SJ2.2 22.49,14.45 R19.1
N$35
  Top 0.203: LED5.C 28.67,26.41 R8.1
N$36  (via drill 0.38)
  Top 0.203: X1.3 33.78,37.67 v33.6,37.67 | U7.P16 22.57,43.5 v22.23,43.16
  Bottom 0.203: v22.23,43.16 23.24,44.17 30.56,44.17 33.6,41.12 v33.6,37.67
N$37
  Top 0.203: LED4.C 29.46,25.82 R5.1
OSC32_IN
  Top 0.203: U3.3 13.68,26.25 13.34,26.59 13.34,28.68 11.86,30.15 Q2.P$2 10.85,30.2 10.85,30.96 11.5,31.61 C10.1
OSC32_OUT
  Top 0.203: U3.4 13.47,25.75 12.83,26.39 12.83,28.37 12.47,28.73 9.02,28.73 Q2.P$1 7.78,30.34 C11.1
OSC_IN
  Top 0.203: U3.5 12.3,25.25 11.86,25.68 11.01,25.68 C8.1 10.45,25.69 10.24,25.48 8.68,25.48 Q1.1
OSC_OUT
  Top 0.203: U3.6 11.17,24.75 C9.1 10.89,24.58 Q1.3
RF24_CS
  Top 0.203: U3.52 22.44,28.36 23.24,27.56 24.26,27.56 25.02,28.32 25.02,29.08 25.27,29.34 30.35,29.34 32.39,27.31 32.39,26.29 32.64,26.04 33.14,26.04 U1.2
RF24_EN
  Top 0.203: U3.51 22.94,28.36 23.24,28.07 24,28.07 24.51,28.57 24.51,29.34 25.02,29.85 30.35,29.85 33.15,27.05 U1.1
RF24_IRQ  (via drill 0.38)
  Top 0.203: U3.40 v28.82,23.25 v28.83,23.24 | U1.6 33.99,23.63 v32.79,22.43
  Bottom 0.203: v32.79,22.43 29.64,22.43 v28.83,23.24
RF24_MISO  (via drill 0.38)
  Top 0.203: 32.91,24.53 32.89,24.51 33.14,24.51 U1.5 32.45,24.53 v31.57,23.65 29.95,22.02 28.12,22.02 26.84,20.75 U3.35 | U9.2 30.22,34.05 30.61,33.66 32.23,33.66 v32.92,34.34 | U10.2 40.46,33.34 v39.7,32.59
  Bottom 0.203: v39.7,32.59 39.7,33.48 38.84,34.34 v32.92,34.34 32.92,28.6 30.35,26.04 30.35,24.87 v31.57,23.65
RF24_MOSI  (via drill 0.38)
  Top 0.203: U10.5 39.16,29.47 37.14,31.5 U9.5 35.46,31.57 v33.81,31.57 | U3.36 26.73,21.25 27.92,22.43 29.34,22.43 v31.57,24.66 31.94,25.03 U1.4
  Bottom 0.203: v31.57,24.66 30.86,25.38 30.86,26.04 33.81,28.98 v33.81,31.57
RF24_SCK  (via drill 0.38)
  Top 0.203: U10.6 39.81,29.51 36.54,32.78 36.53,32.77 U9.6 | U9.6 35.76,32.77 | U3.34 26.95,20.25 28.32,21.62 30.76,21.62 v32.79,23.65 | U1.3 31.72,25.53 v31.57,25.68 | U9.6 35.51,32.79 v33.81,32.79
  Bottom 0.203: v32.79,23.65 32.79,24.46 v31.57,25.68 31.57,26.09 34.62,29.13 34.62,32.08 33.91,32.79 v33.81,32.79
RST  (via drill 0.38)
  Top 0.203: U$1.7 22.68,35.38 22.12,34.82 21.01,34.82 19.63,36.2 18.91,36.2 R3.1 C12.1 17.16,36.04 15.11,36.04 12.81,33.74 S1.3 12.76,33.72 v12.07,34.42 | U3.7 15.3,24.25 15.93,24.87 v15.93,25.88
  Bottom 0.203: v15.93,25.88 15.93,28.32 14.1,30.15 14.1,32.39 v12.07,34.42
SRAM_CS  (via drill 0.38)
  Top 0.203: v22.73,30.35 22.43,30.35 21.94,29.87 U3.53 | v25.53,30.61 25.78,30.35 v30.96,30.35 | U10.1 41.11,32.98 v39.7,31.57
  Bottom 0.203: v22.73,30.35 23.65,29.44 24.36,29.44 v25.53,30.61 | v30.96,30.35 30.96,34.47 31.62,35.13 38.79,35.13 40.51,33.4 40.51,32.39 v39.7,31.57
T0  (via drill 0.38)
  Top 0.203: U3.58 19.44,33.69 19.47,33.69 v19.58,33.81
  Bottom 0.203: v19.58,33.81 19.58,34.01 19.38,34.21 19.38,45.29 21.61,47.52 FP1.T0
T1  (via drill 0.38)
  Top 0.203: U3.59 18.94,33.03 v18.57,33.4
  Bottom 0.203: v18.57,33.4 18.57,33.5 18.72,33.66 18.72,46.02 FP1.T1
T2  (via drill 0.38)
  Top 0.203: U3.61 17.94,28.13 v18.36,27.71
  Bottom 0.203: v18.36,27.71 15.32,30.76 15.32,43 17.65,45.34 17.65,47.5 FP1.T2
T3  (via drill 0.38)
  Top 0.203: U3.62 17.44,27.81 v17.35,27.71
  Bottom 0.203: v17.35,27.71 17.35,28.12 14.91,30.56 14.91,43.1 15.88,44.07 FP1.T3 | FP1.T3
TA0  (via drill 0.38)
  Top 0.203: U3.22 18.94,18.94 v19.38,19.38
  Bottom 0.203: v19.38,19.38 19.38,17.75 18.36,16.74 18.36,16.13 17.75,15.52 8.1,15.52 FP1.TA0
TA1  (via drill 0.38)
  Top 0.203: U3.23 19.44,16.6 v19.18,16.33
  Bottom 0.203: v19.18,16.33 17.96,15.11 11.29,15.11 FP1.TA1
V+  (via drill 0.38)  (2 unrouted)
  Top 0.203: 35.33,8.66 35.33,8.89 | U8.1 30.13,17.17 | 30.13,17.17 30.15,17.14 | SJ5.1 21.49,8.13 v20.6,9.02 | v14.1,12.68 14.1,13.55 | 30.38,3.71 30.37,3.7 FP1.BAT | 32.79,12.07 32.79,11.43 JP6.2 | 30.13,17.17 30.13,15.63 R1.2
  Top 0.305: JP6.2 34.02,10.64
  Top 0.406: U8.1 31.42,17.59 LED1.A LED2.A 30.19,19.43 U8.3
  Top 0.61: 35.33,8.66 30.38,3.71 28.73,5.36 25.07,5.36 24.46,5.97 24.46,7.6 23.93,8.13 SJ5.1
  Top 1.016: C20.1 R1.2 31.49,15.61 32.79,14.3 32.79,12.07
  Bottom 0.203: v14.1,12.68 16.94,12.68 v20.6,9.02